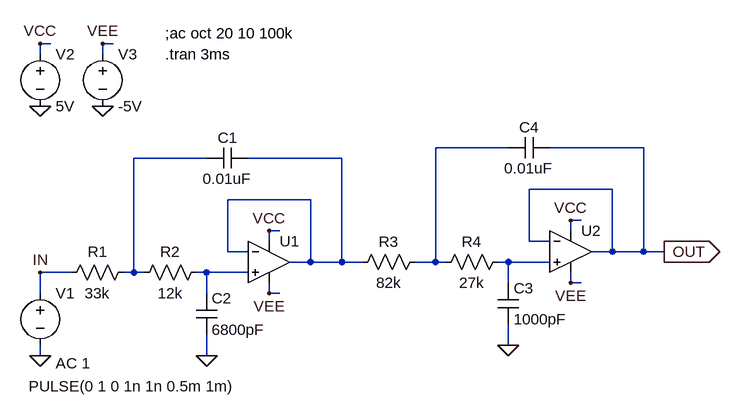
[diagram p0: schematic 4thButterWorthLPF_VCVS.asc]
4thButterWorthLPF_VCVS.asc, the LTspice schematic file:
Version 4
SHEET 1 880 680
WIRE -336 -176 -352 -176
WIRE -240 -176 -256 -176
WIRE -352 -160 -352 -176
WIRE -256 -160 -256 -176
WIRE 368 -16 256 -16
WIRE 576 -16 432 -16
WIRE -96 0 -208 0
WIRE 112 0 -32 0
WIRE 528 48 400 48
WIRE 64 64 -64 64
WIRE 480 96 464 96
WIRE 16 112 0 112
WIRE 464 112 464 96
WIRE 0 128 0 112
WIRE 400 128 400 48
WIRE 432 128 400 128
WIRE -64 144 -64 64
WIRE -32 144 -64 144
WIRE 528 144 528 48
WIRE 528 144 496 144
WIRE 576 144 576 -16
WIRE 576 144 528 144
WIRE 608 144 576 144
WIRE 64 160 64 64
WIRE 64 160 32 160
WIRE 112 160 112 0
WIRE 112 160 64 160
WIRE 144 160 112 160
WIRE 256 160 256 -16
WIRE 256 160 224 160
WIRE 272 160 256 160
WIRE 368 160 352 160
WIRE 432 160 368 160
WIRE -304 176 -352 176
WIRE -208 176 -208 0
WIRE -208 176 -224 176
WIRE -192 176 -208 176
WIRE -96 176 -112 176
WIRE -32 176 -96 176
WIRE 368 192 368 160
WIRE 464 192 464 176
WIRE 480 192 464 192
WIRE -352 208 -352 176
WIRE -96 208 -96 176
WIRE 0 208 0 192
WIRE 16 208 0 208
WIRE 368 288 368 256
WIRE -352 304 -352 288
WIRE -96 304 -96 272
FLAG 0 112 VCC
FLAG 0 208 VEE
FLAG -96 304 0
FLAG -352 304 0
FLAG -352 -80 0
FLAG -256 -80 0
FLAG -352 -176 VCC
FLAG -256 -176 VEE
FLAG 464 96 VCC
FLAG 464 192 VEE
FLAG 368 288 0
FLAG 608 144 OUT
IOPIN 608 144 Out
FLAG -352 176 IN
SYMBOL Opamps\\UniversalOpamp2 0 160 R0
SYMATTR InstName U1
SYMBOL cap -112 208 R0
SYMATTR InstName C2
SYMATTR Value 6800pF
SYMBOL res -208 160 R90
WINDOW 0 0 56 VBottom 2
WINDOW 3 32 56 VTop 2
SYMATTR InstName R1
SYMATTR Value 33k
SYMBOL res -96 160 R90
WINDOW 0 0 56 VBottom 2
WINDOW 3 32 56 VTop 2
SYMATTR InstName R2
SYMATTR Value 12k
SYMBOL cap -32 -16 R90
WINDOW 0 0 32 VBottom 2
WINDOW 3 32 32 VTop 2
SYMATTR InstName C1
SYMATTR Value 0.01uF
SYMBOL voltage -352 192 R0
WINDOW 123 24 124 Left 2
WINDOW 39 0 0 Left 2
WINDOW 3 -18 159 Left 2
SYMATTR Value2 AC 1
SYMATTR Value PULSE(0 1 0 1n 1n 0.5m 1m)
SYMATTR InstName V1
SYMBOL voltage -352 -176 R0
WINDOW 123 0 0 Left 2
WINDOW 39 0 0 Left 2
SYMATTR InstName V2
SYMATTR Value 5V
SYMBOL voltage -256 -176 R0
WINDOW 123 0 0 Left 2
WINDOW 39 0 0 Left 2
SYMATTR InstName V3
SYMATTR Value -5V
SYMBOL Opamps\\UniversalOpamp2 464 144 R0
SYMATTR InstName U2
SYMBOL cap 352 192 R0
SYMATTR InstName C3
SYMATTR Value 1000pF
SYMBOL res 240 144 R90
WINDOW 0 0 56 VBottom 2
WINDOW 3 32 56 VTop 2
SYMATTR InstName R3
SYMATTR Value 82k
SYMBOL res 368 144 R90
WINDOW 0 0 56 VBottom 2
WINDOW 3 32 56 VTop 2
SYMATTR InstName R4
SYMATTR Value 27k
SYMBOL cap 432 -32 R90
WINDOW 0 0 32 VBottom 2
WINDOW 3 32 32 VTop 2
SYMATTR InstName C4
SYMATTR Value 0.01uF
TEXT -160 -192 Left 2 !;ac oct 20 10 100k
TEXT -160 -160 Left 2 !.tran 3ms

The netlist it stands for:
* 4thButterWorthLPF_VCVS.asc
XU1 N005 N003 VCC VEE N003 level.2 Avol=1Meg GBW=10Meg Slew=10Meg ilimit=25m rail=0 Vos=0 phimargin=45 en=0 enk=0 in=0 ink=0 Rin=500Meg  ; pins IN+ IN- V+ V- OUT
C2 N005 0 6800pF
R1 N002 IN 33k
R2 N005 N002 12k
C1 N003 N002 0.01uF
V1 IN 0 PULSE(0 1 0 1n 1n 0.5m 1m) AC 1
V2 VCC 0 5V
V3 VEE 0 -5V
XU2 N004 OUT VCC VEE OUT level.2 Avol=1Meg GBW=10Meg Slew=10Meg ilimit=25m rail=0 Vos=0 phimargin=45 en=0 enk=0 in=0 ink=0 Rin=500Meg  ; pins IN+ IN- V+ V- OUT
C3 N004 0 1000pF
R3 N001 N003 82k
R4 N004 N001 27k
C4 OUT N001 0.01uF
;ac oct 20 10 100k
.tran 3ms
.lib UniversalOpamps2.sub
.backanno
.end